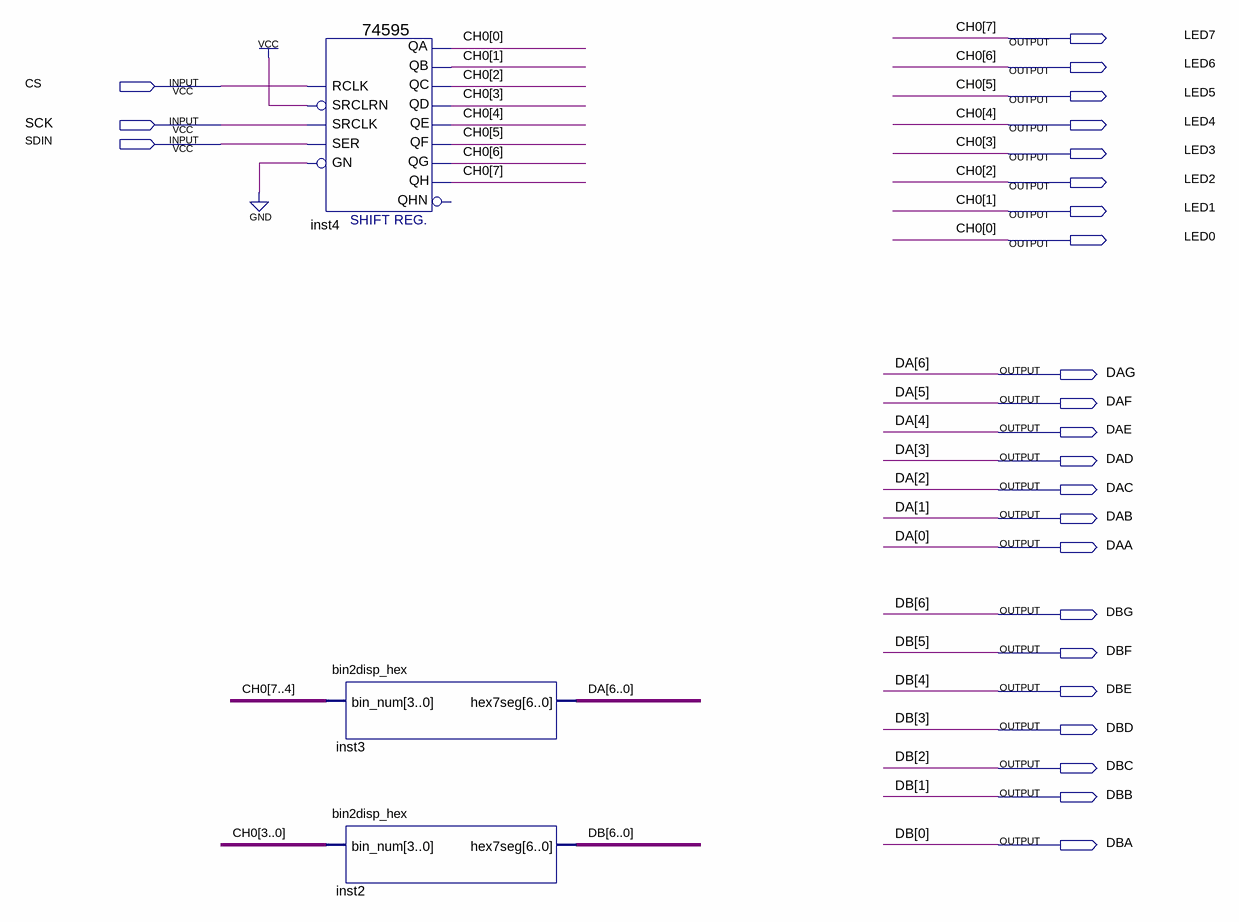
[diagram p0: schematic sheet]
// Quartus schematic MainDiagram.bdf as structural Verilog: 3 symbols, 25 pins
module MainDiagram (
  input  CS,
  input  SCK,
  input  SDIN,
  output LED7,
  output LED6,
  output LED5,
  output LED4,
  output LED3,
  output LED2,
  output LED1,
  output LED0,
  output DAG,
  output DAF,
  output DAE,
  output DAD,
  output DAC,
  output DAB,
  output DAA,
  output DBG,
  output DBF,
  output DBE,
  output DBD,
  output DBC,
  output DBB,
  output DBA
);

  \74595  inst4 (
    .RCLK(CS), .SRCLRN(1'b1), .SRCLK(SCK), .SER(SDIN), .GN(1'b0), .QH(LED7), .QG(LED6), .QF(LED5), .QE(LED4),
    .QC(LED2), .QD(LED3), .QA(LED0), .QB(LED1));  // open: QHN
  bin2disp_hex inst3 (.bin_num({LED7, LED6, LED5, LED4}), .hex7seg({DAG, DAF, DAE, DAD, DAC, DAB, DAA}));
  bin2disp_hex inst2 (.bin_num({LED3, LED2, LED1, LED0}), .hex7seg({DBG, DBF, DBE, DBD, DBC, DBB, DBA}));

  // Other names for the same wires on the sheet: CH0[7:0] = {LED7, LED6, LED5, LED4, LED3, LED2, LED1, LED0};
  //   DA[6:0] = {DAG, DAF, DAE, DAD, DAC, DAB, DAA}; DB[6:0] = {DBG, DBF, DBE, DBD, DBC, DBB, DBA}
endmodule
